# Altium project 202112AH743A100.BrdPrj.PrjPcb
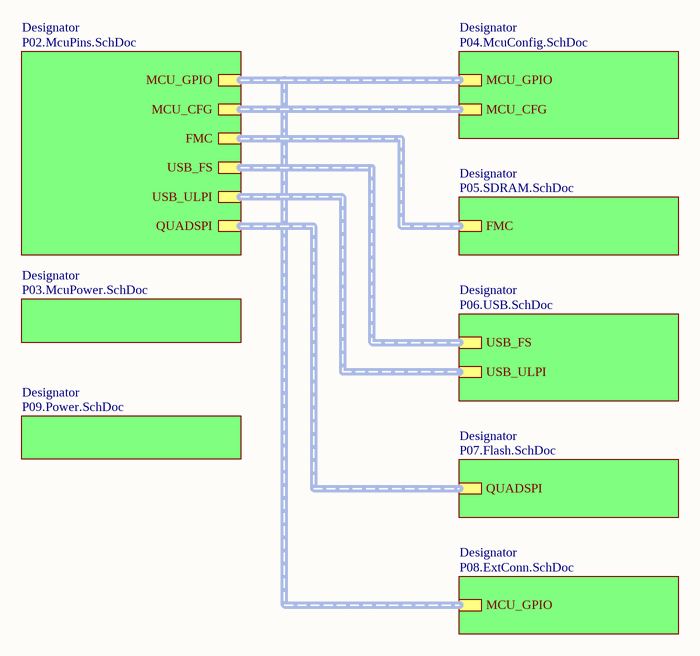
[diagram p0: P01.ModsConn.SchDoc]
9 sheets, 109 parts. Net scope: hierarchical (ports join the sheet entries above them; power ports are global).
Board file: 202112AH743A100.PcbDoc
Sheets:
  P01.ModsConn.SchDoc
    Designator = P02.McuPins.SchDoc
    Designator = P04.McuConfig.SchDoc
    Designator = P05.SDRAM.SchDoc
    Designator = P06.USB.SchDoc
    Designator = P03.McuPower.SchDoc
    Designator = P07.Flash.SchDoc
    Designator = P08.ExtConn.SchDoc
    Designator = P09.Power.SchDoc

## Sheet P01.ModsConn.SchDoc
size A4

### Sub-sheets
Designator = P02.McuPins.SchDoc: USB_FS (harness USB_FS), MCU_GPIO (harness MCU_GPIO), MCU_CFG (harness MCU_CFG), USB_ULPI (harness USB_ULPI), FMC (harness FMC), QUADSPI (harness QUADSPI)
Designator = P04.McuConfig.SchDoc: MCU_CFG (harness MCU_CFG), MCU_GPIO (harness MCU_GPIO)
Designator = P05.SDRAM.SchDoc: FMC (harness FMC)
Designator = P06.USB.SchDoc: USB_ULPI (harness USB_ULPI), USB_FS (harness USB_FS)
Designator = P03.McuPower.SchDoc: no entries
Designator = P07.Flash.SchDoc: QUADSPI (harness QUADSPI)
Designator = P08.ExtConn.SchDoc: MCU_GPIO (harness MCU_GPIO)
Designator = P09.Power.SchDoc: no entries

## Sheet P02.McuPins.SchDoc
size A3
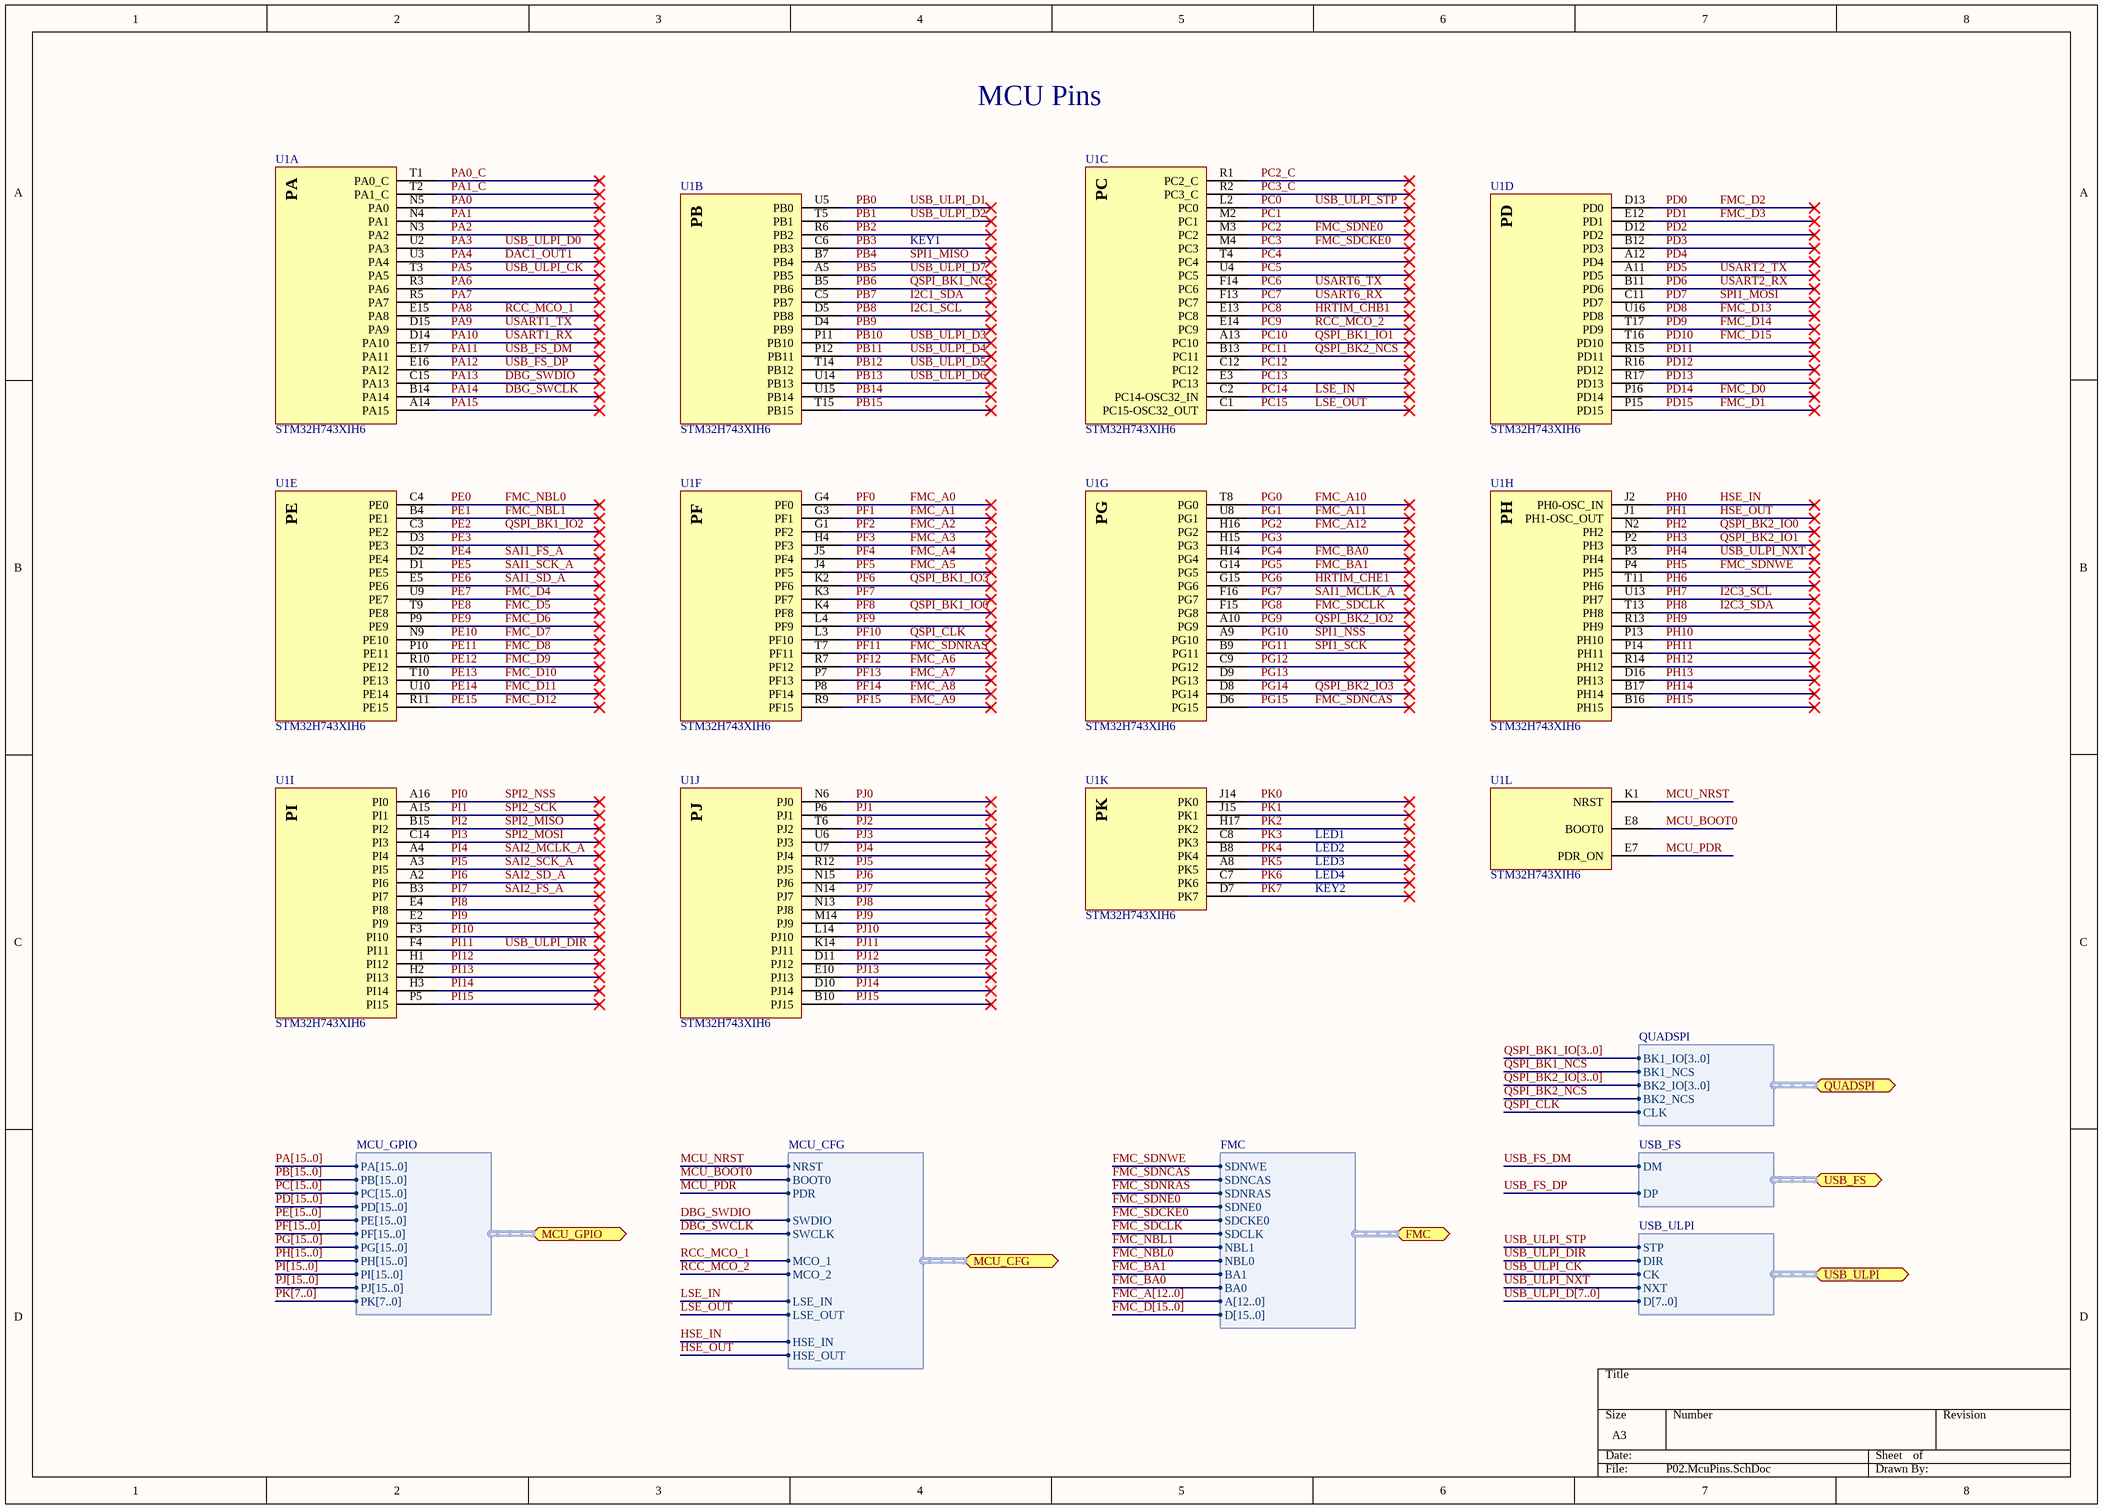
[diagram p1: P02.McuPins.SchDoc]

### Parts
U1  STM32H743XIH6  [STM32H743XIH6-TFBGA240+25]  (parts A,B,C,D,E,F,G,H,I,J,K,L of 14)

### Ports
FMC (bidir, harness FMC), MCU_CFG (bidir, harness MCU_CFG), MCU_GPIO (bidir, harness MCU_GPIO), QUADSPI (bidir, harness QUADSPI), USB_FS (bidir, harness USB_FS), USB_ULPI (bidir, harness USB_ULPI)

### Harnesses
USB_ULPI: STP, DIR, CK, NXT, D[7..0]
MCU_GPIO: PA[15..0], PB[15..0], PC[15..0], PD[15..0], PE[15..0], PF[15..0], PG[15..0], PH[15..0], PI[15..0], PJ[15..0], PK[7..0]
FMC: SDNWE, SDNCAS, SDNRAS, SDNE0, SDCKE0, SDCLK, NBL1, NBL0, BA1, BA0, A[12..0], D[15..0]
MCU_CFG: NRST, BOOT0, PDR, SWDIO, SWCLK, MCO_1, MCO_2, LSE_IN, LSE_OUT, HSE_IN, HSE_OUT
USB_FS: DM, DP
QUADSPI: BK1_IO[3..0], BK1_NCS, BK2_IO[3..0], BK2_NCS, CLK

### Nets
MCU_PDR: U1.E7(PDR_ON) ; port MCU_CFG.PDR
DAC1_OUT1: U1.U3(PA4)  [also labelled PA4]
DBG_SWCLK: U1.B14(PA14) ; port MCU_CFG.SWCLK  [also labelled PA14]
DBG_SWDIO: U1.C15(PA13) ; port MCU_CFG.SWDIO  [also labelled PA13]
FMC_A0: U1.G4(PF0)  [also labelled PF0]
FMC_A1: U1.G3(PF1)  [also labelled PF1]
FMC_A2: U1.G1(PF2)  [also labelled PF2]
FMC_A3: U1.H4(PF3)  [also labelled PF3]
FMC_A4: U1.J5(PF4)  [also labelled PF4]
FMC_A5: U1.J4(PF5)  [also labelled PF5]
FMC_A6: U1.R7(PF12)  [also labelled PF12]
FMC_A7: U1.P7(PF13)  [also labelled PF13]
FMC_A8: U1.P8(PF14)  [also labelled PF14]
FMC_A9: U1.R9(PF15)  [also labelled PF15]
FMC_A10: U1.T8(PG0)  [also labelled PG0]
FMC_A11: U1.U8(PG1)  [also labelled PG1]
FMC_A12: U1.H16(PG2)  [also labelled PG2]
FMC_BA0: U1.H14(PG4) ; port FMC.BA0  [also labelled PG4]
FMC_BA1: U1.G14(PG5) ; port FMC.BA1  [also labelled PG5]
FMC_D0: U1.P16(PD14)  [also labelled PD14]
FMC_D1: U1.P15(PD15)  [also labelled PD15]
FMC_D2: U1.D13(PD0)  [also labelled PD0]
FMC_D3: U1.E12(PD1)  [also labelled PD1]
FMC_D4: U1.U9(PE7)  [also labelled PE7]
FMC_D5: U1.T9(PE8)  [also labelled PE8]
FMC_D6: U1.P9(PE9)  [also labelled PE9]
FMC_D7: U1.N9(PE10)  [also labelled PE10]
FMC_D8: U1.P10(PE11)  [also labelled PE11]
FMC_D9: U1.R10(PE12)  [also labelled PE12]
FMC_D10: U1.T10(PE13)  [also labelled PE13]
FMC_D11: U1.U10(PE14)  [also labelled PE14]
FMC_D12: U1.R11(PE15)  [also labelled PE15]
FMC_D13: U1.U16(PD8)  [also labelled PD8]
FMC_D14: U1.T17(PD9)  [also labelled PD9]
FMC_D15: U1.T16(PD10)  [also labelled PD10]
FMC_NBL0: U1.C4(PE0) ; port FMC.NBL0  [also labelled PE0]
FMC_NBL1: U1.B4(PE1) ; port FMC.NBL1  [also labelled PE1]
FMC_SDCKE0: U1.M4(PC3) ; port FMC.SDCKE0  [also labelled PC3]
FMC_SDCLK: U1.F15(PG8) ; port FMC.SDCLK  [also labelled PG8]
FMC_SDNCAS: U1.D6(PG15) ; port FMC.SDNCAS  [also labelled PG15]
FMC_SDNE0: U1.M3(PC2) ; port FMC.SDNE0  [also labelled PC2]
FMC_SDNRAS: U1.T7(PF11) ; port FMC.SDNRAS  [also labelled PF11]
FMC_SDNWE: U1.P4(PH5) ; port FMC.SDNWE  [also labelled PH5]
HRTIM_CHB1: U1.E13(PC8)  [also labelled PC8]
HRTIM_CHE1: U1.G15(PG6)  [also labelled PG6]
HSE_IN: U1.J2(PH0-OSC_IN) ; port MCU_CFG.HSE_IN  [also labelled PH0]
HSE_OUT: U1.J1(PH1-OSC_OUT) ; port MCU_CFG.HSE_OUT  [also labelled PH1]
I2C1_SCL: U1.D5(PB8)  [also labelled PB8]
I2C1_SDA: U1.C5(PB7)  [also labelled PB7]
I2C3_SCL: U1.U13(PH7)  [also labelled PH7]
I2C3_SDA: U1.T13(PH8)  [also labelled PH8]
LSE_IN: U1.C2(PC14-OSC32_IN) ; port MCU_CFG.LSE_IN  [also labelled PC14]
LSE_OUT: U1.C1(PC15-OSC32_OUT) ; port MCU_CFG.LSE_OUT  [also labelled PC15]
MCU_BOOT0: U1.E8(BOOT0) ; port MCU_CFG.BOOT0
MCU_NRST: U1.K1(NRST) ; port MCU_CFG.NRST
PA0: U1.N5(PA0)
PA0_C: U1.T1(PA0_C)
PA1: U1.N4(PA1)
PA1_C: U1.T2(PA1_C)
PA2: U1.N3(PA2)
PA3: U1.U2(PA3)  [also labelled USB_ULPI_D0]
PA5: U1.T3(PA5) ; port USB_ULPI.CK  [also labelled USB_ULPI_CK]
PA6: U1.R3(PA6)
PA7: U1.R5(PA7)
PA8: U1.E15(PA8) ; port MCU_CFG.MCO_1  [also labelled RCC_MCO_1]
PA9: U1.D15(PA9)  [also labelled USART1_TX]
PA10: U1.D14(PA10)  [also labelled USART1_RX]
PA11: U1.E17(PA11) ; port USB_FS.DM  [also labelled USB_FS_DM]
PA12: U1.E16(PA12) ; port USB_FS.DP  [also labelled USB_FS_DP]
PA15: U1.A14(PA15)
PB0: U1.U5(PB0)  [also labelled USB_ULPI_D1]
PB1: U1.T5(PB1)  [also labelled USB_ULPI_D2]
PB2: U1.R6(PB2)
PB3: U1.C6(PB3)
PB4: U1.B7(PB4)  [also labelled SPI1_MISO]
PB5: U1.A5(PB5)  [also labelled USB_ULPI_D7]
PB6: U1.B5(PB6) ; port QUADSPI.BK1_NCS  [also labelled QSPI_BK1_NCS]
PB9: U1.D4(PB9)
PB10: U1.P11(PB10)  [also labelled USB_ULPI_D3]
PB11: U1.P12(PB11)  [also labelled USB_ULPI_D4]
PB12: U1.T14(PB12)  [also labelled USB_ULPI_D5]
PB13: U1.U14(PB13)  [also labelled USB_ULPI_D6]
PB14: U1.U15(PB14)
PB15: U1.T15(PB15)
PC0: U1.L2(PC0) ; port USB_ULPI.STP  [also labelled USB_ULPI_STP]
PC1: U1.M2(PC1)
PC2_C: U1.R1(PC2_C)
PC3_C: U1.R2(PC3_C)
PC4: U1.T4(PC4)
PC5: U1.U4(PC5)
PC6: U1.F14(PC6)  [also labelled USART6_TX]
PC7: U1.F13(PC7)  [also labelled USART6_RX]
PC9: U1.E14(PC9) ; port MCU_CFG.MCO_2  [also labelled RCC_MCO_2]
PC10: U1.A13(PC10)  [also labelled QSPI_BK1_IO1]
PC11: U1.B13(PC11) ; port QUADSPI.BK2_NCS  [also labelled QSPI_BK2_NCS]
PC12: U1.C12(PC12)
PC13: U1.E3(PC13)
PD2: U1.D12(PD2)
PD3: U1.B12(PD3)
PD4: U1.A12(PD4)
PD5: U1.A11(PD5)  [also labelled USART2_TX]
PD6: U1.B11(PD6)  [also labelled USART2_RX]
PD7: U1.C11(PD7)  [also labelled SPI1_MOSI]
PD11: U1.R15(PD11)
PD12: U1.R16(PD12)
PD13: U1.R17(PD13)
PE2: U1.C3(PE2)  [also labelled QSPI_BK1_IO2]
PE3: U1.D3(PE3)
PE4: U1.D2(PE4)  [also labelled SAI1_FS_A]
PE5: U1.D1(PE5)  [also labelled SAI1_SCK_A]
PE6: U1.E5(PE6)  [also labelled SAI1_SD_A]
PF6: U1.K2(PF6)  [also labelled QSPI_BK1_IO3]
PF7: U1.K3(PF7)
PF8: U1.K4(PF8)  [also labelled QSPI_BK1_IO0]
PF9: U1.L4(PF9)
PF10: U1.L3(PF10) ; port QUADSPI.CLK  [also labelled QSPI_CLK]
PG3: U1.H15(PG3)
PG7: U1.F16(PG7)  [also labelled SAI1_MCLK_A]
PG9: U1.A10(PG9)  [also labelled QSPI_BK2_IO2]
PG10: U1.A9(PG10)  [also labelled SPI1_NSS]
PG11: U1.B9(PG11)  [also labelled SPI1_SCK]
PG12: U1.C9(PG12)
PG13: U1.D9(PG13)
PG14: U1.D8(PG14)  [also labelled QSPI_BK2_IO3]
PH2: U1.N2(PH2)  [also labelled QSPI_BK2_IO0]
PH3: U1.P2(PH3)  [also labelled QSPI_BK2_IO1]
PH4: U1.P3(PH4) ; port USB_ULPI.NXT  [also labelled USB_ULPI_NXT]
PH6: U1.T11(PH6)
PH9: U1.R13(PH9)
PH10: U1.P13(PH10)
PH11: U1.P14(PH11)
PH12: U1.R14(PH12)
PH13: U1.D16(PH13)
PH14: U1.B17(PH14)
PH15: U1.B16(PH15)
PI0: U1.A16(PI0)  [also labelled SPI2_NSS]
PI1: U1.A15(PI1)  [also labelled SPI2_SCK]
PI2: U1.B15(PI2)  [also labelled SPI2_MISO]
PI3: U1.C14(PI3)  [also labelled SPI2_MOSI]
PI4: U1.A4(PI4)  [also labelled SAI2_MCLK_A]
PI5: U1.A3(PI5)  [also labelled SAI2_SCK_A]
PI6: U1.A2(PI6)  [also labelled SAI2_SD_A]
PI7: U1.B3(PI7)  [also labelled SAI2_FS_A]
PI8: U1.E4(PI8)
PI9: U1.E2(PI9)
PI10: U1.F3(PI10)
PI11: U1.F4(PI11) ; port USB_ULPI.DIR  [also labelled USB_ULPI_DIR]
PI12: U1.H1(PI12)
PI13: U1.H2(PI13)
PI14: U1.H3(PI14)
PI15: U1.P5(PI15)
PJ0: U1.N6(PJ0)
PJ1: U1.P6(PJ1)
PJ2: U1.T6(PJ2)
PJ3: U1.U6(PJ3)
PJ4: U1.U7(PJ4)
PJ5: U1.R12(PJ5)
PJ6: U1.N15(PJ6)
PJ7: U1.N14(PJ7)
PJ8: U1.N13(PJ8)
PJ9: U1.M14(PJ9)
PJ10: U1.L14(PJ10)
PJ11: U1.K14(PJ11)
PJ12: U1.D11(PJ12)
PJ13: U1.E10(PJ13)
PJ14: U1.D10(PJ14)
PJ15: U1.B10(PJ15)
PK0: U1.J14(PK0)
PK1: U1.J15(PK1)
PK2: U1.H17(PK2)
PK3: U1.C8(PK3)
PK4: U1.B8(PK4)
PK5: U1.A8(PK5)
PK6: U1.C7(PK6)
PK7: U1.D7(PK7)

### Buses and harness runs
bus FMC_A[12..0]
bus FMC_D[15..0]
bus PA[15..0]
bus PB[15..0]
bus PC[15..0]
bus PD[15..0]
bus PE[15..0]
bus PF[15..0]
bus PG[15..0]
bus PH[15..0]
bus PI[15..0]
bus PJ[15..0]
bus PK[7..0]
bus QSPI_BK1_IO[3..0]
bus QSPI_BK2_IO[3..0]
bus USB_ULPI_D[7..0]

### Notes on the sheet
- MCU Pins
- KEY1
- LED1
- LED2
- LED3
- LED4
- KEY2
- (in symbol STM32H743XIH6, part A) PA
- (in symbol STM32H743XIH6, part B) PB
- (in symbol STM32H743XIH6, part C) PC
- (in symbol STM32H743XIH6, part D) PD
- (in symbol STM32H743XIH6, part E) PE
- (in symbol STM32H743XIH6, part F) PF
- (in symbol STM32H743XIH6, part G) PG
- (in symbol STM32H743XIH6, part H) PH
- (in symbol STM32H743XIH6, part I) PI
- (in symbol STM32H743XIH6, part J) PJ
- (in symbol STM32H743XIH6, part K) PK

### Library data of the parts
U1 = STM32H743XIH6: 32-bit Arm® Cortex®-M7 480MHz MCUs, up to 2MB Flash,up to 1MB RAM, 46 com. and analog interfaces

## Sheet P04.McuConfig.SchDoc
size A4
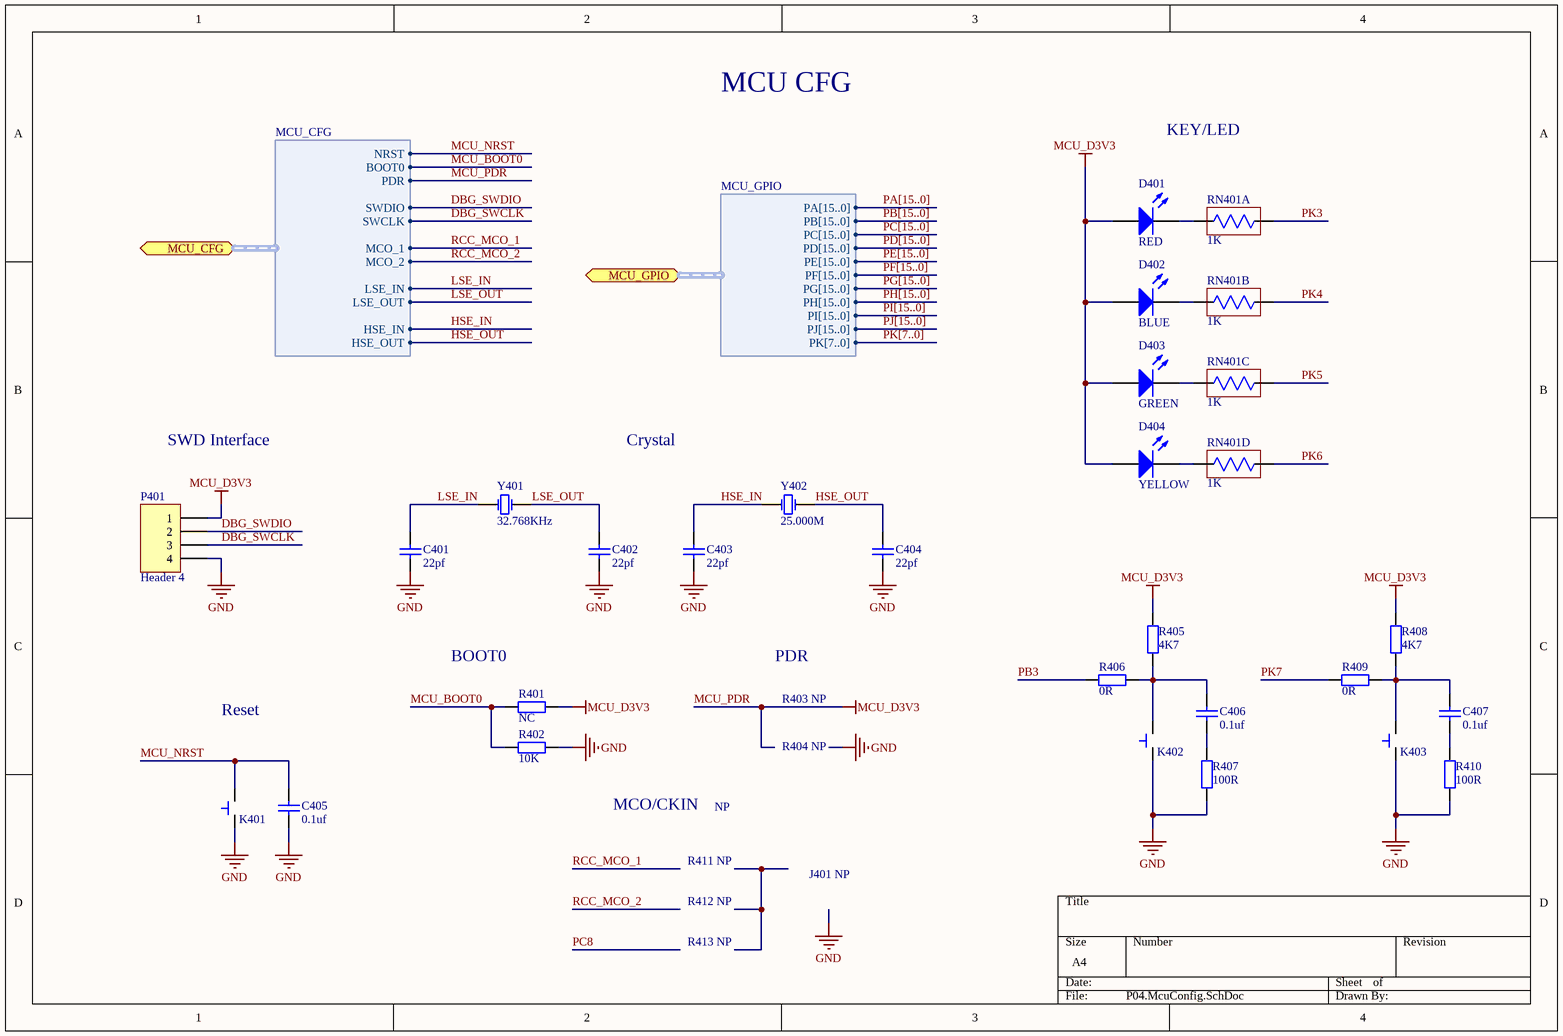
[diagram p2: P04.McuConfig.SchDoc]

### Parts
C401  value 22pf  [C0402]  (hidden comment: Cap)
C402  value 22pf  [C0402]  (hidden comment: Cap)
C403  value 22pf  [C0402]  (hidden comment: Cap)
C404  value 22pf  [C0402]  (hidden comment: Cap)
C405  value 0.1uf  [C0603]  (hidden comment: Cap)
C406  value 0.1uf  [C0603]  (hidden comment: Cap)
C407  value 0.1uf  [C0603]  (hidden comment: Cap)
D401  value RED  [LED0603]  (hidden comment: LED)
D402  value BLUE  [LED0603]  (hidden comment: LED)
D403  value GREEN  [LED0603]  (hidden comment: LED)
D404  value YELLOW  [LED0603]  (hidden comment: LED)
K401  Button  [Button-SMD-3.0x4.0x2.0]  (value not drawn)
K402  Button  [Button-SMD-3.0x4.0x2.0]  (value not drawn)
K403  Button  [Button-SMD-3.0x4.0x2.0]  (value not drawn)
P401  Header 4  [HDR1X4]
R401  value NC  [R0603]  (hidden comment: Res)
R402  value 10K  [R0603]  (hidden comment: Res)
R405  value 4K7  [R0603]  (hidden comment: Res)
R406  value 0R  [R0603]  (hidden comment: Res)
R407  value 100R  [R0603]  (hidden comment: Res)
R408  value 4K7  [R0603]  (hidden comment: Res)
R409  value 0R  [R0603]  (hidden comment: Res)
R410  value 100R  [R0603]  (hidden comment: Res)
RN401  value 1K  [RA0603]  (hidden comment: Res Array)  (parts A,B,C,D of 4)
Y401  value 32.768KHz  [XTAL-3215]  (hidden comment: XTAL)
Y402  value 25.000M  [XTAL-3225]  (hidden comment: XTAL)

### Ports
MCU_CFG (bidir, harness MCU_CFG), MCU_GPIO (bidir, harness MCU_GPIO)

### Harnesses
MCU_CFG: NRST, BOOT0, PDR, SWDIO, SWCLK, MCO_1, MCO_2, LSE_IN, LSE_OUT, HSE_IN, HSE_OUT
MCU_GPIO: PA[15..0], PB[15..0], PC[15..0], PD[15..0], PE[15..0], PF[15..0], PG[15..0], PH[15..0], PI[15..0], PJ[15..0], PK[7..0]

### Nets
GND: C401.1 C402.1 C403.1 C404.1 C405.1 K401.1(IN) K402.1(IN) K403.1(IN) P401.4 R402.2 R407.1 R410.1
MCU_PDR: D401.1(A) D402.1(A) D403.1(A) D404.1(A) P401.1 R401.2 R405.2 R408.2 ; port MCU_CFG.PDR  [also labelled MCU_D3V3]
DBG_SWCLK: P401.3 ; port MCU_CFG.SWCLK
DBG_SWDIO: P401.2 ; port MCU_CFG.SWDIO
HSE_IN: C403.2 Y402.1(OSC1) ; port MCU_CFG.HSE_IN
HSE_OUT: C404.2 Y402.3(OSC2) ; port MCU_CFG.HSE_OUT
LSE_IN: C401.2 Y401.1(OSC1) ; port MCU_CFG.LSE_IN
LSE_OUT: C402.2 Y401.2(OSC2) ; port MCU_CFG.LSE_OUT
MCU_BOOT0: R401.1 R402.1 ; port MCU_CFG.BOOT0
MCU_NRST: C405.2 K401.2(OUT) ; port MCU_CFG.NRST
PB3: R406.1
PK3: RN401.8
PK4: RN401.7
PK5: RN401.6
PK6: RN401.5
PK7: R409.1
NetC406_1: C406.1 R407.2
NetC406_2: C406.2 K402.2(OUT) R405.1 R406.2
NetC407_1: C407.1 R410.2
NetC407_2: C407.2 K403.2(OUT) R408.1 R409.2
NetD401_2: D401.2(K) RN401.1
NetD402_2: D402.2(K) RN401.2
NetD403_2: D403.2(K) RN401.3
NetD404_2: D404.2(K) RN401.4

### Buses and harness runs
bus PA[15..0]
bus PB[15..0]
bus PC[15..0]
bus PD[15..0]
bus PE[15..0]
bus PF[15..0]
bus PG[15..0]
bus PH[15..0]
bus PI[15..0]
bus PJ[15..0]
bus PK[7..0]

### Notes on the sheet
- MCU CFG
- KEY/LED
- SWD Interface
- Crystal
- Reset
- (near R401) BOOT0
- PDR
- R403 NP
- R404 NP
- MCO/CKIN
- NP
- R411 NP
- R412 NP
- J401 NP
- R413 NP

### Library data of the parts
K401-K403 = Button: 微动开关
P401 = Header 4: Header, 4-Pin; LatestRevisionDate: 17-Jul-2002; LatestRevisionNote: Re-released for DXP Platform.; Publisher: Altium Limited
R401 R402 R405-R410 = Res: 电阻
RN401 = Res Array 2: 贴片排阻
Y401 = XTAL: Crystal Oscillator
Y402 = XTAL3: Crystal Oscillator

## Sheet P05.SDRAM.SchDoc
size A4
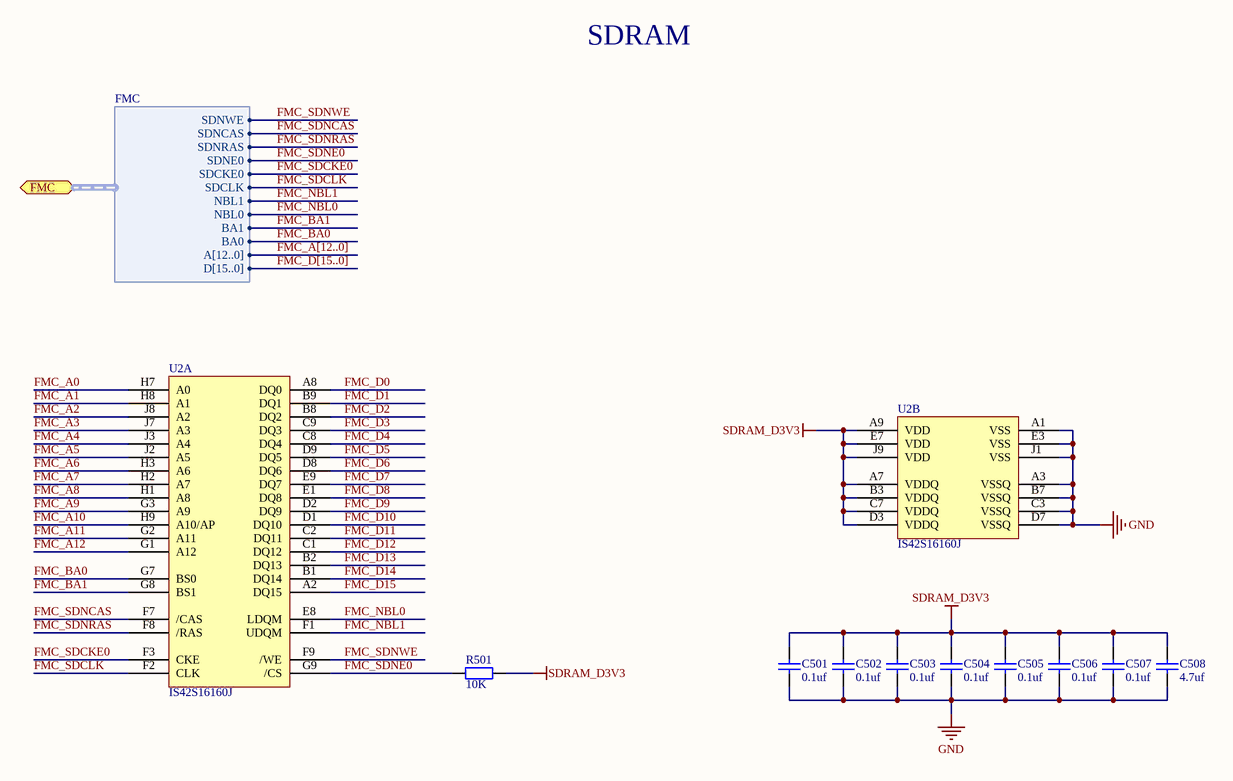
[diagram p3: P05.SDRAM.SchDoc]

### Parts
C501  value 0.1uf  [C0402]  (hidden comment: Cap)
C502  value 0.1uf  [C0402]  (hidden comment: Cap)
C503  value 0.1uf  [C0402]  (hidden comment: Cap)
C504  value 0.1uf  [C0402]  (hidden comment: Cap)
C505  value 0.1uf  [C0402]  (hidden comment: Cap)
C506  value 0.1uf  [C0402]  (hidden comment: Cap)
C507  value 0.1uf  [C0402]  (hidden comment: Cap)
C508  value 4.7uf  [C0603]  (hidden comment: Cap)
R501  value 10K  [R0603]  (hidden comment: Res)
U2  IS42S16160J  [IS42S16160J-TFBGA54]  (parts A,B of 2)

### Ports
FMC (bidir, harness FMC)

### Harnesses
FMC: SDNWE, SDNCAS, SDNRAS, SDNE0, SDCKE0, SDCLK, NBL1, NBL0, BA1, BA0, A[12..0], D[15..0]

### Nets
GND: C501.1 C502.1 C503.1 C504.1 C505.1 C506.1 C507.1 C508.1 U2.A1(VSS) U2.A3(VSSQ) U2.B7(VSSQ) U2.C3(VSSQ) U2.D7(VSSQ) U2.E3(VSS) U2.J1(VSS)
SDRAM_D3V3: C501.2 C502.2 C503.2 C504.2 C505.2 C506.2 C507.2 C508.2 R501.2 U2.A7(VDDQ) U2.A9(VDD) U2.B3(VDDQ) U2.C7(VDDQ) U2.D3(VDDQ) U2.E7(VDD) U2.J9(VDD)
FMC_A0: U2.H7(A0)
FMC_A1: U2.H8(A1)
FMC_A2: U2.J8(A2)
FMC_A3: U2.J7(A3)
FMC_A4: U2.J3(A4)
FMC_A5: U2.J2(A5)
FMC_A6: U2.H3(A6)
FMC_A7: U2.H2(A7)
FMC_A8: U2.H1(A8)
FMC_A9: U2.G3(A9)
FMC_A10: U2.H9(A10/AP)
FMC_A11: U2.G2(A11)
FMC_A12: U2.G1(A12)
FMC_BA0: U2.G7(BS0) ; port FMC.BA0
FMC_BA1: U2.G8(BS1) ; port FMC.BA1
FMC_D0: U2.A8(DQ0)
FMC_D1: U2.B9(DQ1)
FMC_D2: U2.B8(DQ2)
FMC_D3: U2.C9(DQ3)
FMC_D4: U2.C8(DQ4)
FMC_D5: U2.D9(DQ5)
FMC_D6: U2.D8(DQ6)
FMC_D7: U2.E9(DQ7)
FMC_D8: U2.E1(DQ8)
FMC_D9: U2.D2(DQ9)
FMC_D10: U2.D1(DQ10)
FMC_D11: U2.C2(DQ11)
FMC_D12: U2.C1(DQ12)
FMC_D13: U2.B2(DQ13)
FMC_D14: U2.B1(DQ14)
FMC_D15: U2.A2(DQ15)
FMC_NBL0: U2.E8(LDQM) ; port FMC.NBL0
FMC_NBL1: U2.F1(UDQM) ; port FMC.NBL1
FMC_SDCKE0: U2.F3(CKE) ; port FMC.SDCKE0
FMC_SDCLK: U2.F2(CLK) ; port FMC.SDCLK
FMC_SDNCAS: U2.F7(/CAS) ; port FMC.SDNCAS
FMC_SDNE0: R501.1 U2.G9(/CS) ; port FMC.SDNE0
FMC_SDNRAS: U2.F8(/RAS) ; port FMC.SDNRAS
FMC_SDNWE: U2.F9(/WE) ; port FMC.SDNWE

### Buses and harness runs
bus FMC_A[12..0]
bus FMC_D[15..0]

### Notes on the sheet
- SDRAM

### Library data of the parts
R501 = Res: 电阻
U2 = IS42S16160J: 32Meg x 8, 16Meg x16, 256Mb SYNCHRONOUS DRAM

## Sheet P06.USB.SchDoc
size A4
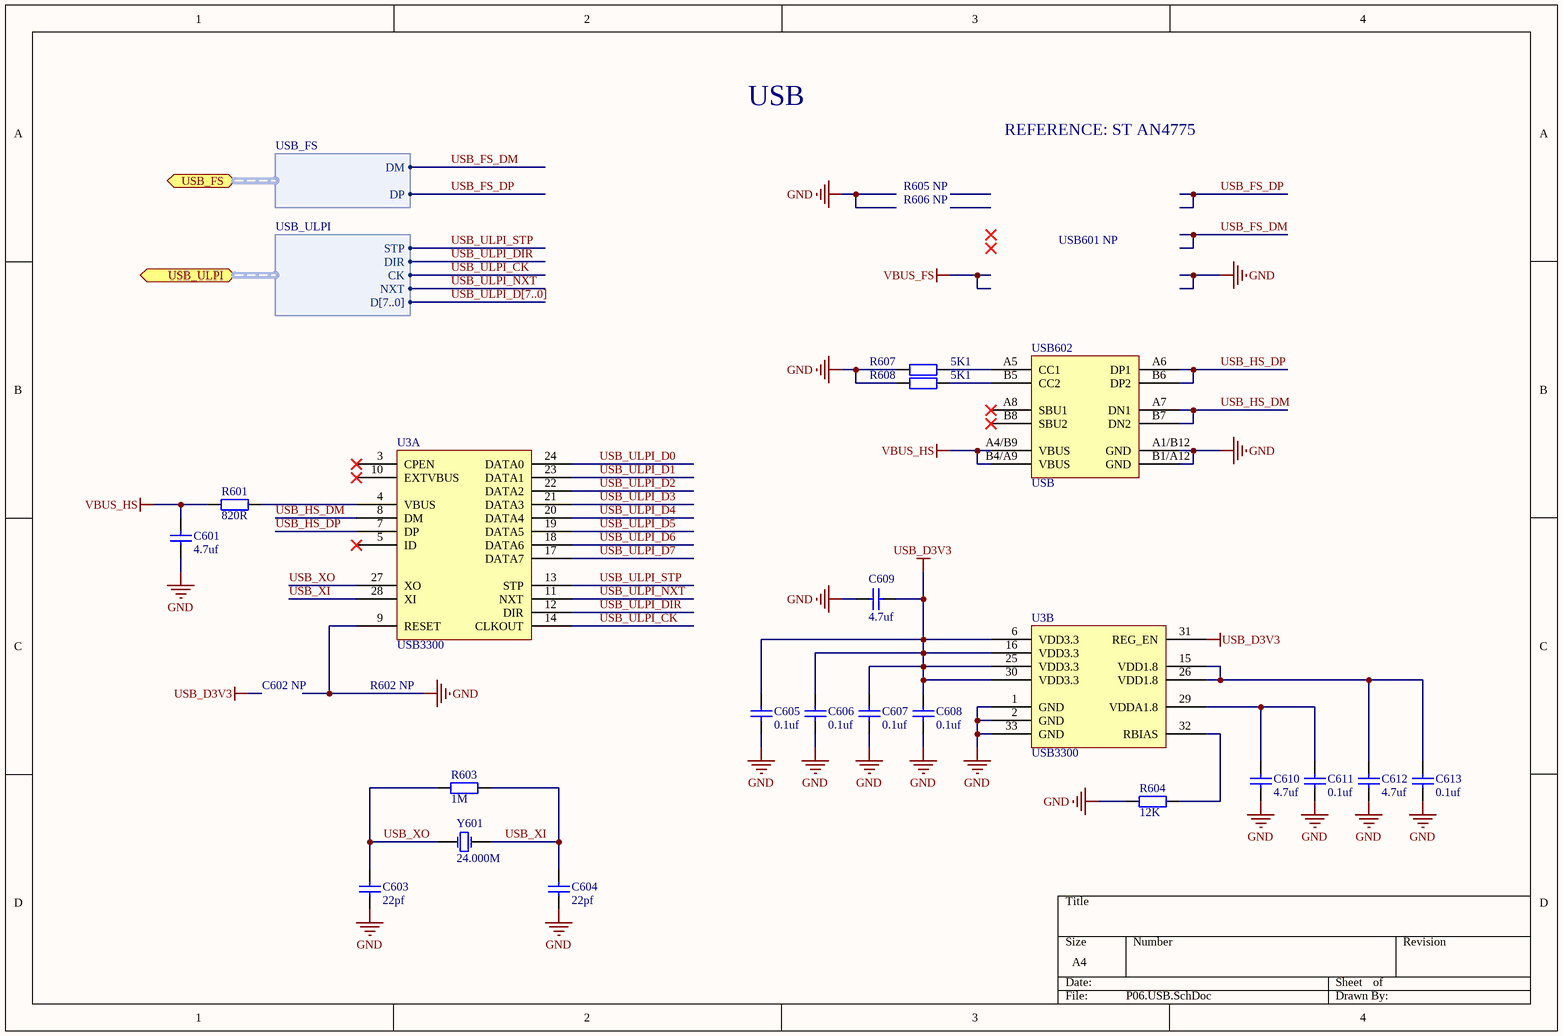
[diagram p4: P06.USB.SchDoc]

### Parts
C601  value 4.7uf  [C0603]  (hidden comment: Cap)
C603  value 22pf  [C0603]  (hidden comment: Cap)
C604  value 22pf  [C0603]  (hidden comment: Cap)
C605  value 0.1uf  [C0402]  (hidden comment: Cap)
C606  value 0.1uf  [C0402]  (hidden comment: Cap)
C607  value 0.1uf  [C0402]  (hidden comment: Cap)
C608  value 0.1uf  [C0402]  (hidden comment: Cap)
C609  value 4.7uf  [C0603]  (hidden comment: Cap)
C610  value 4.7uf  [C0402]  (hidden comment: Cap)
C611  value 0.1uf  [C0402]  (hidden comment: Cap)
C612  value 4.7uf  [C0402]  (hidden comment: Cap)
C613  value 0.1uf  [C0402]  (hidden comment: Cap)
R601  value 820R  [R0603]  (hidden comment: Res)
R603  value 1M  [R0603]  (hidden comment: Res)
R604  value 12K  [R0603]  (hidden comment: Res)
R607  value 5K1  [R0603]  (hidden comment: Res)
R608  value 5K1  [R0603]  (hidden comment: Res)
U3  USB3300  [USB3300-QFN32]  (parts A,B of 2)
USB602  USB  [USB-TYPEC-F-16P-THD]
Y601  value 24.000M  [XTAL-3225]  (hidden comment: XTAL)

### Ports
USB_FS (bidir, harness USB_FS), USB_ULPI (bidir, harness USB_ULPI)

### Harnesses
USB_ULPI: STP, DIR, CK, NXT, D[7..0]
USB_FS: DM, DP

### Nets
GND: C601.1 C603.1 C604.1 C605.1 C606.1 C607.1 C608.1 C609.1 C610.1 C611.1 C612.1 C613.1 R604.1 R607.1 R608.1 U3.1(GND) U3.2(GND) U3.9(RESET) U3.33(GND) USB602.A1/B12(GND) USB602.B1/A12(GND)
USB_D3V3: C605.2 C606.2 C607.2 C608.2 C609.2 U3.6(VDD3.3) U3.16(VDD3.3) U3.25(VDD3.3) U3.30(VDD3.3) U3.31(REG_EN)  [project net FLASH_D3V3]
VBUS_HS: C601.2 R601.1 USB602.A4/B9(VBUS) USB602.B4/A9(VBUS)
USB_HS_DM: U3.8(DM) USB602.A7(DN1) USB602.B7(DN2)
USB_HS_DP: U3.7(DP) USB602.A6(DP1) USB602.B6(DP2)
USB_ULPI_CK: U3.14(CLKOUT) ; port USB_ULPI.CK  [project net PA5]
USB_ULPI_D0: U3.24(DATA0)  [project net PA3]
USB_ULPI_D1: U3.23(DATA1)  [project net PB0]
USB_ULPI_D2: U3.22(DATA2)  [project net PB1]
USB_ULPI_D3: U3.21(DATA3)  [project net PB10]
USB_ULPI_D4: U3.20(DATA4)  [project net PB11]
USB_ULPI_D5: U3.19(DATA5)  [project net PB12]
USB_ULPI_D6: U3.18(DATA6)  [project net PB13]
USB_ULPI_D7: U3.17(DATA7)  [project net PB5]
USB_ULPI_DIR: U3.12(DIR) ; port USB_ULPI.DIR  [project net PI11]
USB_ULPI_NXT: U3.11(NXT) ; port USB_ULPI.NXT  [project net PH4]
USB_ULPI_STP: U3.13(STP) ; port USB_ULPI.STP  [project net PC0]
USB_XI: C604.2 R603.2 U3.28(XI) Y601.3(OSC2)
USB_XO: C603.2 R603.1 U3.27(XO) Y601.1(OSC1)
NetC610_2: C610.2 C611.2 U3.29(VDDA1.8)
NetC612_2: C612.2 C613.2 U3.15(VDD1.8) U3.26(VDD1.8)
NetR601_2: R601.2 U3.4(VBUS)
NetR604_2: R604.2 U3.32(RBIAS)
NetR607_2: R607.2 USB602.A5(CC1)
NetR608_2: R608.2 USB602.B5(CC2)

Not connected (* = marked no-connect by the designer): U3 3(CPEN)* 5(ID)* 10(EXTVBUS)*; USB602 A8(SBU1)* B8(SBU2)*

### Buses and harness runs
bus USB_ULPI_D[7..0]

### Notes on the sheet
- USB
- REFERENCE: ST AN4775
- R605 NP
- R606 NP
- USB601 NP
- C602 NP
- R602 NP

### Library data of the parts
R601 R603 R604 R607 R608 = Res: 电阻
U3 = USB3300: Hi-Speed USB Host, Device or OTG PHY with ULPI Low Pin Interface
USB602 = USB3
Y601 = XTAL3: Crystal Oscillator

## Sheet P03.McuPower.SchDoc
size A4
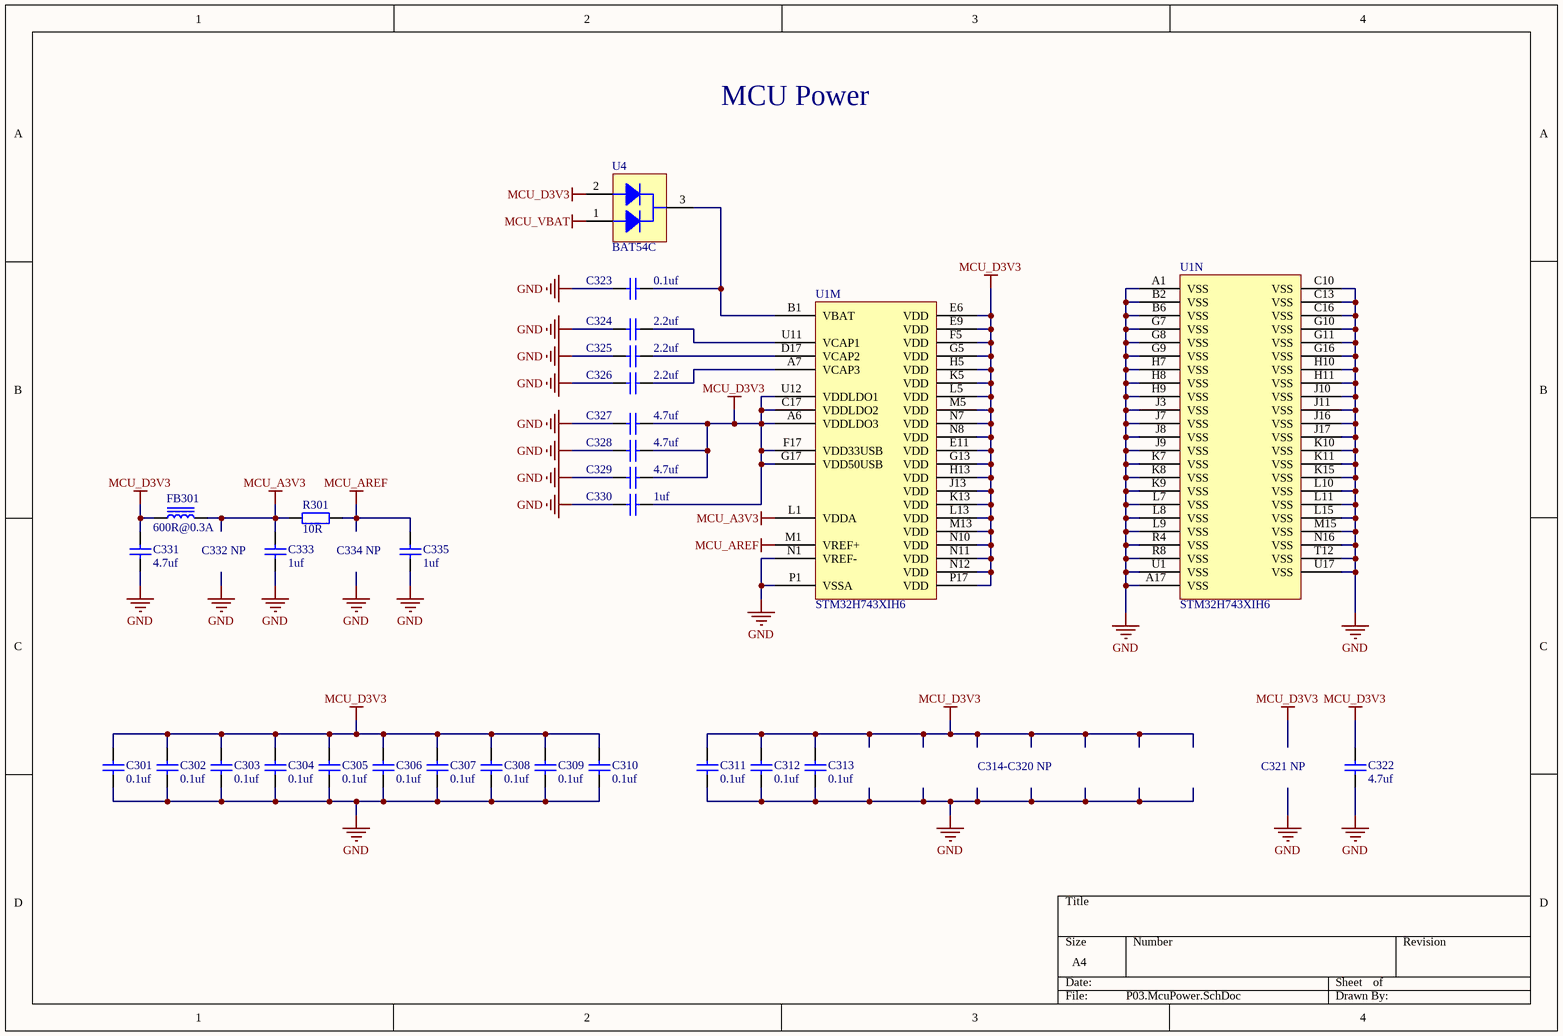
[diagram p5: P03.McuPower.SchDoc]

### Parts
C301  value 0.1uf  [C0402]  (hidden comment: Cap)
C302  value 0.1uf  [C0402]  (hidden comment: Cap)
C303  value 0.1uf  [C0402]  (hidden comment: Cap)
C304  value 0.1uf  [C0402]  (hidden comment: Cap)
C305  value 0.1uf  [C0402]  (hidden comment: Cap)
C306  value 0.1uf  [C0402]  (hidden comment: Cap)
C307  value 0.1uf  [C0402]  (hidden comment: Cap)
C308  value 0.1uf  [C0402]  (hidden comment: Cap)
C309  value 0.1uf  [C0402]  (hidden comment: Cap)
C310  value 0.1uf  [C0402]  (hidden comment: Cap)
C311  value 0.1uf  [C0402]  (hidden comment: Cap)
C312  value 0.1uf  [C0402]  (hidden comment: Cap)
C313  value 0.1uf  [C0402]  (hidden comment: Cap)
C322  value 4.7uf  [C0603]  (hidden comment: Cap)
C323  value 0.1uf  [C0402]  (hidden comment: Cap)
C324  value 2.2uf  [C0402]  (hidden comment: Cap)
C325  value 2.2uf  [C0402]  (hidden comment: Cap)
C326  value 2.2uf  [C0402]  (hidden comment: Cap)
C327  value 4.7uf  [C0402]  (hidden comment: Cap)
C328  value 4.7uf  [C0402]  (hidden comment: Cap)
C329  value 4.7uf  [C0402]  (hidden comment: Cap)
C330  value 1uf  [C0402]  (hidden comment: Cap)
C331  value 4.7uf  [C0402]  (hidden comment: Cap)
C333  value 1uf  [C0402]  (hidden comment: Cap)
C335  value 1uf  [C0402]  (hidden comment: Cap)
FB301  value 600R@0.3A  [FB0402]  (hidden comment: Ferrite Bead)
R301  value 10R  [R0402]  (hidden comment: Res)
U1  STM32H743XIH6  [STM32H743XIH6-TFBGA240+25]  (parts M,N of 14)
U4  BAT54C  [BAT54X-SOT23]

### Nets
GND: C301.1 C302.1 C303.1 C304.1 C305.1 C306.1 C307.1 C308.1 C309.1 C310.1 C311.1 C312.1 C313.1 C322.1 C323.1 C324.1 C325.1 C326.1 C327.1 C328.1 C329.1 C330.1 C331.1 C333.1 C335.1 U1.A1(VSS) U1.A17(VSS) U1.B2(VSS) U1.B6(VSS) U1.C10(VSS) U1.C13(VSS) U1.C16(VSS) U1.G7(VSS) U1.G8(VSS) U1.G9(VSS) U1.G10(VSS) U1.G11(VSS) U1.G16(VSS) U1.H7(VSS) U1.H8(VSS) U1.H9(VSS) U1.H10(VSS) U1.H11(VSS) U1.J3(VSS) U1.J7(VSS) U1.J8(VSS) U1.J9(VSS) U1.J10(VSS) U1.J11(VSS) U1.J16(VSS) U1.J17(VSS) U1.K7(VSS) U1.K8(VSS) U1.K9(VSS) U1.K10(VSS) U1.K11(VSS) U1.K15(VSS) U1.L7(VSS) U1.L8(VSS) U1.L9(VSS) U1.L10(VSS) U1.L11(VSS) U1.L15(VSS) U1.M15(VSS) U1.N1(VREF-) U1.N16(VSS) U1.P1(VSSA) U1.R4(VSS) U1.R8(VSS) U1.T12(VSS) U1.U1(VSS) U1.U17(VSS)
MCU_A3V3: C333.2 FB301.2 R301.1 U1.L1(VDDA)
MCU_AREF: C335.2 R301.2 U1.M1(VREF+)
MCU_D3V3: C301.2 C302.2 C303.2 C304.2 C305.2 C306.2 C307.2 C308.2 C309.2 C310.2 C311.2 C312.2 C313.2 C322.2 C327.2 C328.2 C329.2 C330.2 C331.2 FB301.1 U1.A6(VDDLDO3) U1.C17(VDDLDO2) U1.E6(VDD) U1.E9(VDD) U1.E11(VDD) U1.F5(VDD) U1.F17(VDD33USB) U1.G5(VDD) U1.G13(VDD) U1.G17(VDD50USB) U1.H5(VDD) U1.H13(VDD) U1.J13(VDD) U1.K5(VDD) U1.K13(VDD) U1.L5(VDD) U1.L13(VDD) U1.M5(VDD) U1.M13(VDD) U1.N7(VDD) U1.N8(VDD) U1.N10(VDD) U1.N11(VDD) U1.N12(VDD) U1.P17(VDD) U1.U12(VDDLDO1) U4.2  [project net MCU_PDR]
MCU_VBAT: U4.1
NetC323_2: C323.2 U1.B1(VBAT) U4.3
NetC324_2: C324.2 U1.U11(VCAP1)
NetC325_2: C325.2 U1.D17(VCAP2)
NetC326_2: C326.2 U1.A7(VCAP3)

### Notes on the sheet
- MCU Power
- C332 NP
- C334 NP
- C314-C320 NP
- (near C322) C321 NP

### Library data of the parts
R301 = Res: 电阻
U1 = STM32H743XIH6: as U1 on sheet P02.McuPins
U4 = BAT54C: Schottky barrier diodes

## Sheet P07.Flash.SchDoc
size A4
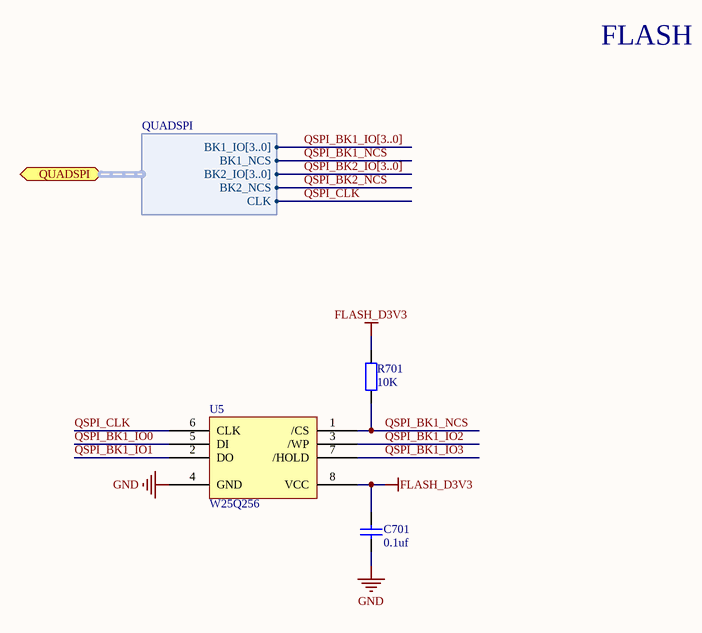
[diagram p6: P07.Flash.SchDoc]

### Parts
C701  value 0.1uf  [C0603]  (hidden comment: Cap)
R701  value 10K  [R0603]  (hidden comment: Res)
U5  W25Q256  [W25Q256-WSON8-8X6]

### Ports
QUADSPI (bidir, harness QUADSPI)

### Harnesses
QUADSPI: BK1_IO[3..0], BK1_NCS, BK2_IO[3..0], BK2_NCS, CLK

### Nets
FLASH_D3V3: C701.2 R701.2 U5.8(VCC)
GND: C701.1 U5.4(GND)
QSPI_BK1_IO0: U5.5(DI)  [project net PF8]
QSPI_BK1_IO1: U5.2(DO)  [project net PC10]
QSPI_BK1_IO2: U5.3(/WP)  [project net PE2]
QSPI_BK1_IO3: U5.7(/HOLD)  [project net PF6]
QSPI_BK1_NCS: R701.1 U5.1(/CS) ; port QUADSPI.BK1_NCS  [project net PB6]
QSPI_CLK: U5.6(CLK) ; port QUADSPI.CLK  [project net PF10]

### Buses and harness runs
bus QSPI_BK1_IO[3..0]
bus QSPI_BK2_IO[3..0]

### Notes on the sheet
- FLASH

### Library data of the parts
R701 = Res: 电阻
U5 = W25Q256: 256M-BIT SERIAL FLASH MEMORY WITH DUAL, QUAD SPI

## Sheet P08.ExtConn.SchDoc
size A4
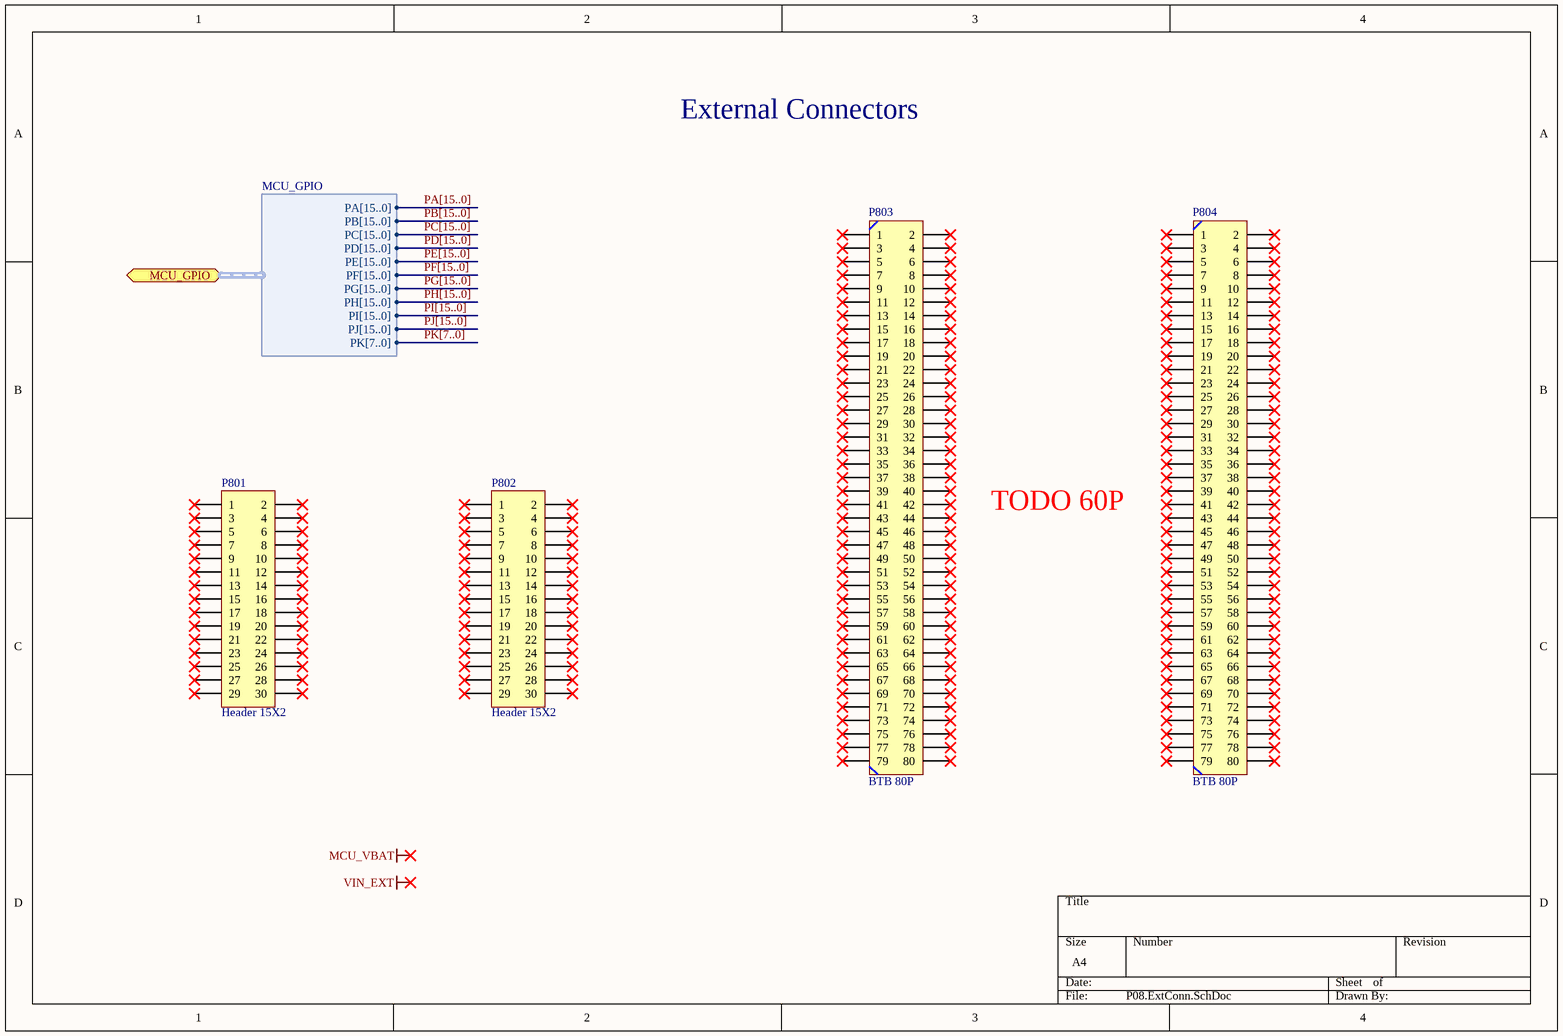
[diagram p7: P08.ExtConn.SchDoc]

### Parts
P801  Header 15X2  [HDR2X15]
P802  Header 15X2  [HDR2X15]
P803  BTB 80P  [BTB-0.8mm-80P-F]
P804  BTB 80P  [BTB-0.8mm-80P-F]

### Ports
MCU_GPIO (bidir, harness MCU_GPIO)

### Harnesses
MCU_GPIO: PA[15..0], PB[15..0], PC[15..0], PD[15..0], PE[15..0], PF[15..0], PG[15..0], PH[15..0], PI[15..0], PJ[15..0], PK[7..0]

### Nets

Not connected (* = marked no-connect by the designer): P801 1* 2* 3* 4* 5* 6* 7* 8* 9* 10* 11* 12* 13* 14* 15* 16* 17* 18* 19* 20* 21* 22* 23* 24* 25* 26* 27* 28* 29* 30*; P802 1* 2* 3* 4* 5* 6* 7* 8* 9* 10* 11* 12* 13* 14* 15* 16* 17* 18* 19* 20* 21* 22* 23* 24* 25* 26* 27* 28* 29* 30*; P803 1* 2* 3* 4* 5* 6* 7* 8* 9* 10* 11* 12* 13* 14* 15* 16* 17* 18* 19* 20* 21* 22* 23* 24* 25* 26* 27* 28* 29* 30* 31* 32* 33* 34* 35* 36* 37* 38* 39* 40* 41* 42* 43* 44* 45* 46* 47* 48* 49* 50* 51* 52* 53* 54* 55* 56* 57* 58* 59* 60* 61* 62* 63* 64* 65* 66* 67* 68* 69* 70* 71* 72* 73* 74* 75* 76* 77* 78* 79* 80*; P804 1* 2* 3* 4* 5* 6* 7* 8* 9* 10* 11* 12* 13* 14* 15* 16* 17* 18* 19* 20* 21* 22* 23* 24* 25* 26* 27* 28* 29* 30* 31* 32* 33* 34* 35* 36* 37* 38* 39* 40* 41* 42* 43* 44* 45* 46* 47* 48* 49* 50* 51* 52* 53* 54* 55* 56* 57* 58* 59* 60* 61* 62* 63* 64* 65* 66* 67* 68* 69* 70* 71* 72* 73* 74* 75* 76* 77* 78* 79* 80*

### Buses and harness runs
bus PA[15..0]
bus PB[15..0]
bus PC[15..0]
bus PD[15..0]
bus PE[15..0]
bus PF[15..0]
bus PG[15..0]
bus PH[15..0]
bus PI[15..0]
bus PJ[15..0]
bus PK[7..0]

### Notes on the sheet
- External Connectors
- TODO 60P
- Labels drawn without touching a wire or pin: MCU_VBAT, VIN_EXT

### Library data of the parts
P801 P802 = Header 15X2: Header, 15-Pin, Dual row; LatestRevisionDate: 17-Jul-2002; LatestRevisionNote: Re-released for DXP Platform.; Publisher: Altium Limited
P803 P804 = CON BTB 80P: Free Height, PCB Mount Receptacle, Vertical, Board-to-Board, 80 Position, .8mm [.031in] Centerline, Gold, Printed Circuit Board; LatestRevisionDate: 17-Jul-2002; LatestRevisionNote: Re-released for DXP Platform.; Publisher: Altium Limited

## Sheet P09.Power.SchDoc
size A4
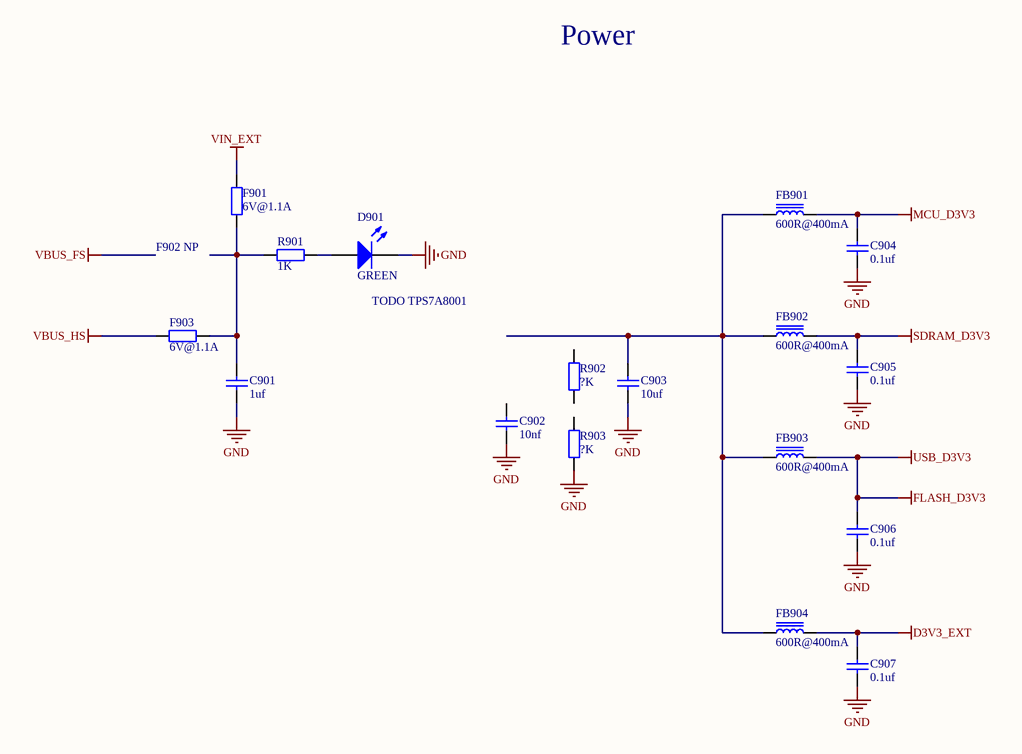
[diagram p8: P09.Power.SchDoc]

### Parts
C901  value 1uf  [C0603]  (hidden comment: Cap)
C902  value 10nf  [C0603]  (hidden comment: Cap)
C903  value 10uf  [C0805]  (hidden comment: Cap)
C904  value 0.1uf  [C0603]  (hidden comment: Cap)
C905  value 0.1uf  [C0603]  (hidden comment: Cap)
C906  value 0.1uf  [C0603]  (hidden comment: Cap)
C907  value 0.1uf  [C0603]  (hidden comment: Cap)
D901  value GREEN  [LED0603]  (hidden comment: LED)
F901  value 6V@1.1A  [F0805]  (hidden comment: Fuse)
F903  value 6V@1.1A  [F0805]  (hidden comment: Fuse)
FB901  value 600R@400mA  [FB0603]  (hidden comment: Ferrite Bead)
FB902  value 600R@400mA  [FB0603]  (hidden comment: Ferrite Bead)
FB903  value 600R@400mA  [FB0603]  (hidden comment: Ferrite Bead)
FB904  value 600R@400mA  [FB0603]  (hidden comment: Ferrite Bead)
R901  value 1K  [R0603]  (hidden comment: Res)
R902  value ?K  [R0603]  (hidden comment: Res)
R903  value ?K  [R0603]  (hidden comment: Res)

### Nets
D3V3_EXT: C907.2 FB904.2
FLASH_D3V3: C906.2 FB903.2  [also labelled USB_D3V3]
GND: C901.1 C902.1 C903.1 C904.1 C905.1 C906.1 C907.1 D901.2(K) R903.1
MCU_D3V3: C904.2 FB901.2  [project net MCU_PDR]
SDRAM_D3V3: C905.2 FB902.2
VBUS_HS: F903.1
VIN_EXT: F901.2
NetC901_2: C901.2 F901.1 F903.2 R901.1
NetC903_2: C903.2 FB901.1 FB902.1 FB903.1 FB904.1
NetD901_1: D901.1(A) R901.2

Not connected (* = marked no-connect by the designer): C902 2; R902 1 2; R903 2

### Notes on the sheet
- Power
- (near F901) F902 NP
- (near D901) TODO TPS7A8001

### Library data of the parts
R901-R903 = Res: 电阻

## Nets that join several sheets
FLASH_D3V3: P06.USB (10 pins), P07.Flash (C701.2 R701.2 U5.8), P09.Power (C906.2 FB903.2)
GND: P04.McuConfig (12 pins), P05.SDRAM (15 pins), P06.USB (21 pins), P03.McuPower (72 pins), P07.Flash (C701.1 U5.4), P09.Power (9 pins)
MCU_PDR: P02.McuPins (U1.E7), P04.McuConfig (8 pins), P03.McuPower (47 pins), P09.Power (C904.2 FB901.2)
SDRAM_D3V3: P05.SDRAM (16 pins), P09.Power (C905.2 FB902.2)
VBUS_HS: P06.USB (C601.2 R601.1 USB602.A4/B9 USB602.B4/A9), P09.Power (F903.1)
DBG_SWCLK: P02.McuPins (U1.B14), P04.McuConfig (P401.3)
DBG_SWDIO: P02.McuPins (U1.C15), P04.McuConfig (P401.2)
FMC_A0: P02.McuPins (U1.G4), P05.SDRAM (U2.H7)
FMC_A1: P02.McuPins (U1.G3), P05.SDRAM (U2.H8)
FMC_A2: P02.McuPins (U1.G1), P05.SDRAM (U2.J8)
FMC_A3: P02.McuPins (U1.H4), P05.SDRAM (U2.J7)
FMC_A4: P02.McuPins (U1.J5), P05.SDRAM (U2.J3)
FMC_A5: P02.McuPins (U1.J4), P05.SDRAM (U2.J2)
FMC_A6: P02.McuPins (U1.R7), P05.SDRAM (U2.H3)
FMC_A7: P02.McuPins (U1.P7), P05.SDRAM (U2.H2)
FMC_A8: P02.McuPins (U1.P8), P05.SDRAM (U2.H1)
FMC_A9: P02.McuPins (U1.R9), P05.SDRAM (U2.G3)
FMC_A10: P02.McuPins (U1.T8), P05.SDRAM (U2.H9)
FMC_A11: P02.McuPins (U1.U8), P05.SDRAM (U2.G2)
FMC_A12: P02.McuPins (U1.H16), P05.SDRAM (U2.G1)
FMC_BA0: P02.McuPins (U1.H14), P05.SDRAM (U2.G7)
FMC_BA1: P02.McuPins (U1.G14), P05.SDRAM (U2.G8)
FMC_D0: P02.McuPins (U1.P16), P05.SDRAM (U2.A8)
FMC_D1: P02.McuPins (U1.P15), P05.SDRAM (U2.B9)
FMC_D2: P02.McuPins (U1.D13), P05.SDRAM (U2.B8)
FMC_D3: P02.McuPins (U1.E12), P05.SDRAM (U2.C9)
FMC_D4: P02.McuPins (U1.U9), P05.SDRAM (U2.C8)
FMC_D5: P02.McuPins (U1.T9), P05.SDRAM (U2.D9)
FMC_D6: P02.McuPins (U1.P9), P05.SDRAM (U2.D8)
FMC_D7: P02.McuPins (U1.N9), P05.SDRAM (U2.E9)
FMC_D8: P02.McuPins (U1.P10), P05.SDRAM (U2.E1)
FMC_D9: P02.McuPins (U1.R10), P05.SDRAM (U2.D2)
FMC_D10: P02.McuPins (U1.T10), P05.SDRAM (U2.D1)
FMC_D11: P02.McuPins (U1.U10), P05.SDRAM (U2.C2)
FMC_D12: P02.McuPins (U1.R11), P05.SDRAM (U2.C1)
FMC_D13: P02.McuPins (U1.U16), P05.SDRAM (U2.B2)
FMC_D14: P02.McuPins (U1.T17), P05.SDRAM (U2.B1)
FMC_D15: P02.McuPins (U1.T16), P05.SDRAM (U2.A2)
FMC_NBL0: P02.McuPins (U1.C4), P05.SDRAM (U2.E8)
FMC_NBL1: P02.McuPins (U1.B4), P05.SDRAM (U2.F1)
FMC_SDCKE0: P02.McuPins (U1.M4), P05.SDRAM (U2.F3)
FMC_SDCLK: P02.McuPins (U1.F15), P05.SDRAM (U2.F2)
FMC_SDNCAS: P02.McuPins (U1.D6), P05.SDRAM (U2.F7)
FMC_SDNE0: P02.McuPins (U1.M3), P05.SDRAM (R501.1 U2.G9)
FMC_SDNRAS: P02.McuPins (U1.T7), P05.SDRAM (U2.F8)
FMC_SDNWE: P02.McuPins (U1.P4), P05.SDRAM (U2.F9)
HSE_IN: P02.McuPins (U1.J2), P04.McuConfig (C403.2 Y402.1)
HSE_OUT: P02.McuPins (U1.J1), P04.McuConfig (C404.2 Y402.3)
LSE_IN: P02.McuPins (U1.C2), P04.McuConfig (C401.2 Y401.1)
LSE_OUT: P02.McuPins (U1.C1), P04.McuConfig (C402.2 Y401.2)
MCU_BOOT0: P02.McuPins (U1.E8), P04.McuConfig (R401.1 R402.1)
MCU_NRST: P02.McuPins (U1.K1), P04.McuConfig (C405.2 K401.2)
PA3: P02.McuPins (U1.U2), P06.USB (U3.24)
PA5: P02.McuPins (U1.T3), P06.USB (U3.14)
PB0: P02.McuPins (U1.U5), P06.USB (U3.23)
PB1: P02.McuPins (U1.T5), P06.USB (U3.22)
PB3: P02.McuPins (U1.C6), P04.McuConfig (R406.1)
PB5: P02.McuPins (U1.A5), P06.USB (U3.17)
PB6: P02.McuPins (U1.B5), P07.Flash (R701.1 U5.1)
PB10: P02.McuPins (U1.P11), P06.USB (U3.21)
PB11: P02.McuPins (U1.P12), P06.USB (U3.20)
PB12: P02.McuPins (U1.T14), P06.USB (U3.19)
PB13: P02.McuPins (U1.U14), P06.USB (U3.18)
PC0: P02.McuPins (U1.L2), P06.USB (U3.13)
PC10: P02.McuPins (U1.A13), P07.Flash (U5.2)
PE2: P02.McuPins (U1.C3), P07.Flash (U5.3)
PF6: P02.McuPins (U1.K2), P07.Flash (U5.7)
PF8: P02.McuPins (U1.K4), P07.Flash (U5.5)
PF10: P02.McuPins (U1.L3), P07.Flash (U5.6)
PH4: P02.McuPins (U1.P3), P06.USB (U3.11)
PI11: P02.McuPins (U1.F4), P06.USB (U3.12)
PK3: P02.McuPins (U1.C8), P04.McuConfig (RN401.8)
PK4: P02.McuPins (U1.B8), P04.McuConfig (RN401.7)
PK5: P02.McuPins (U1.A8), P04.McuConfig (RN401.6)
PK6: P02.McuPins (U1.C7), P04.McuConfig (RN401.5)
PK7: P02.McuPins (U1.D7), P04.McuConfig (R409.1)